# EAGLE schematic OmniRotor-v1 (EAGLE 5.10)
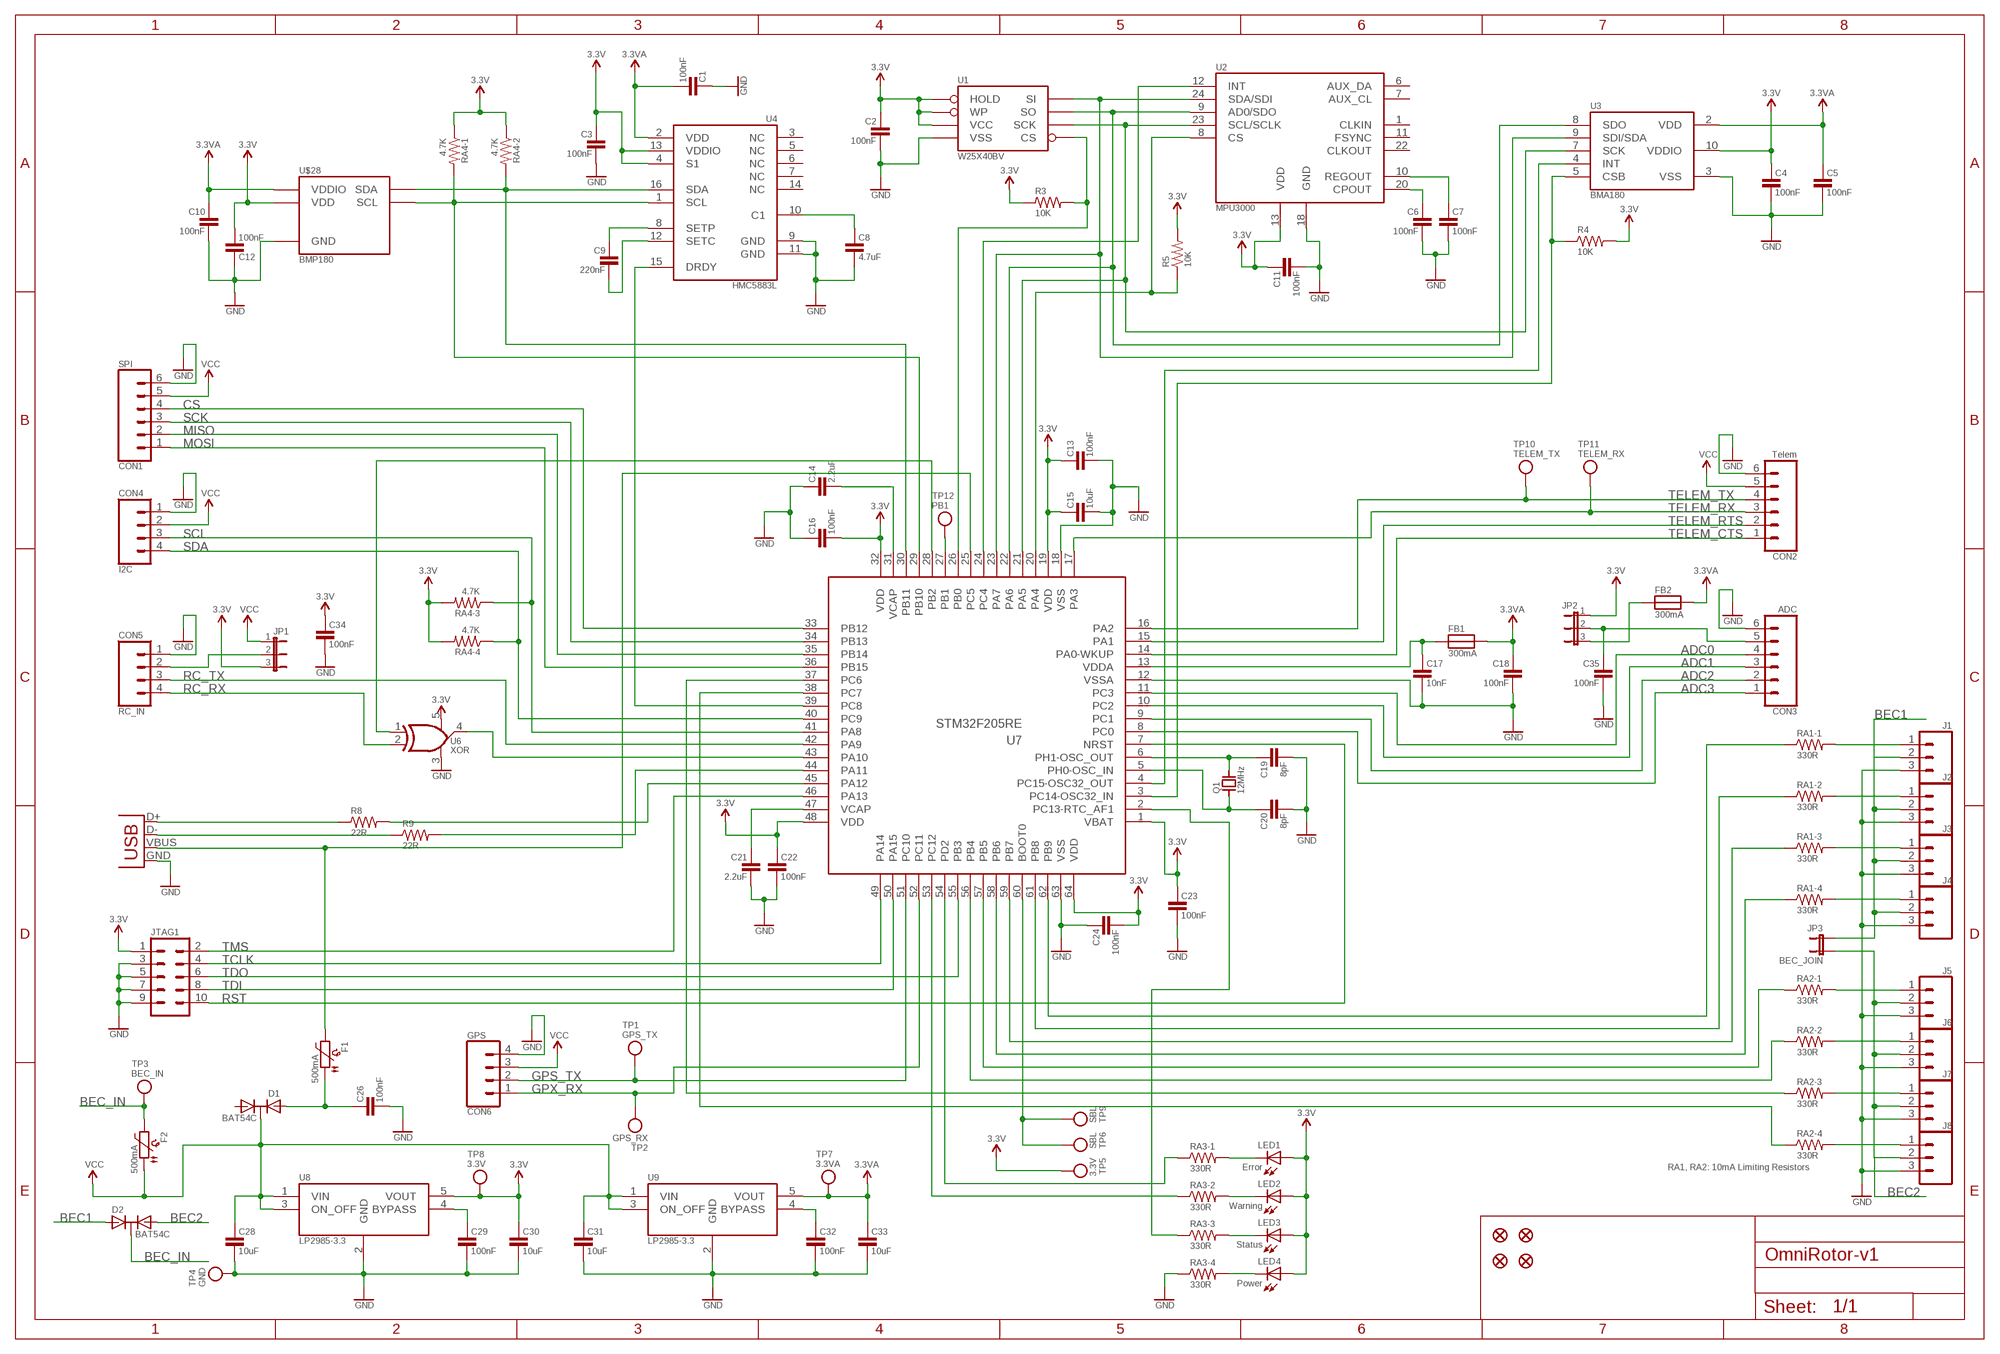
[diagram p0: schematic, sheet 1]

## Parts
C1  100nF  CAPACITOR0402  [0402-CAP]
C2  100nF  CAPACITOR0402  [0402-CAP]
C3  100nF  CAPACITOR0402  [0402-CAP]
C4  100nF  CAPACITOR0402  [0402-CAP]
C5  100nF  CAPACITOR0402  [0402-CAP]
C6  100nF  CAPACITOR0402  [0402-CAP]
C7  100nF  CAPACITOR0402  [0402-CAP]
C8  4.7uF  CAPACITOR0603  [0603]
C9  220nF  CAPACITOR0402  [0402-CAP]
C10  100nF  CAPACITOR0402  [0402-CAP]
C11  100nF  CAPACITOR0402  [0402-CAP]
C12  100nF  CAPACITOR0402  [0402-CAP]
C13  100nF  CAPACITOR0402  [0402-CAP]
C14  2.2uF  CAPACITOR0603  [0603]
C15  10uF  CAPACITOR-CERAMIC0805  [0805]
C16  100nF  CAPACITOR0402  [0402-CAP]
C17  10nF  CAPACITOR0402  [0402-CAP]
C18  100nF  CAPACITOR0402  [0402-CAP]
C19  8pF  CAPACITOR0402  [0402-CAP]
C20  8pF  CAPACITOR0402  [0402-CAP]
C21  2.2uF  CAPACITOR0603  [0603]
C22  100nF  CAPACITOR0402  [0402-CAP]
C23  100nF  CAPACITOR0402  [0402-CAP]
C24  100nF  CAPACITOR0402  [0402-CAP]
C26  100nF  CAPACITOR0402  [0402-CAP]
C28  10uF  CAPACITOR-CERAMIC0805  [0805]
C29  100nF  CAPACITOR0402  [0402-CAP]
C30  10uF  CAPACITOR-CERAMIC0805  [0805]
C31  10uF  CAPACITOR-CERAMIC0805  [0805]
C32  100nF  CAPACITOR0402  [0402-CAP]
C33  10uF  CAPACITOR-CERAMIC0805  [0805]
C34  100nF  CAPACITOR0402  [0402-CAP]
C35  100nF  CAPACITOR0402  [0402-CAP]
CON1  SPI  M06JST-SH-SIDE  [SM06B-SRSS-TB]
CON2  Telem  M06JST-SH-SIDE  [SM06B-SRSS-TB]
CON3  ADC  M06JST-SH-SIDE  [SM06B-SRSS-TB]
CON4  I2C  M04JST-SH-SIDE  [SM04B-SRSS-TB]
CON5  RC_IN  M04JST-SH-SIDE  [SM04B-SRSS-TB]
CON6  GPS  M04JST-SH-SIDE  [SM04B-SRSS-TB]
D1  BAT54C  [SOT23]
D2  BAT54C  [SOT23]
F1  500mA  PTC1812  [1812]
F2  500mA  PTC1812  [1812]
FB1  300mA  FERRITE0603  [0603]
FB2  300mA  FERRITE0603  [0603]
FID1  FIDUCIAL1X2.5  [FIDUCIAL-1X2.5]
FID2  FIDUCIAL1X2.5  [FIDUCIAL-1X2.5]
FID3  FIDUCIAL1X2.5  [FIDUCIAL-1X2.5]
FID4  FIDUCIAL1X2.5  [FIDUCIAL-1X2.5]
J1  M03PTH  [1X03]
J2  M03PTH  [1X03]
J3  M03PTH  [1X03]
J4  M03PTH  [1X03]
J5  M03PTH  [1X03]
J6  M03PTH  [1X03]
J7  M03PTH  [1X03]
J8  M03PTH  [1X03]
JP1  JUMPER-32-3  [SJ_3_PASTE2&3]
JP2  JUMPER-31-2  [SJ_3_PASTE1&2]
JP3  BEC_JOIN  JUMPER-2NO  [SJ_2_NO]
JTAG1  JTAGSWD  [2X05-0.05IN]
LED1  Error  LED0603-LP  [0603_LED_VLPXXX_LIGHTPIPES]
LED2  Warning  LED0603-LP  [0603_LED_VLPXXX_LIGHTPIPES]
LED3  Status  LED0603-LP  [0603_LED_VLPXXX_LIGHTPIPES]
LED4  Power  LED0603-LP  [0603_LED_VLPXXX_LIGHTPIPES]
Q1  12MHz  CRYSTAL5X3-2  [CRYSTAL-5X3-2]
R3  10K  RESISTOR0402  [0402-RES]
R4  10K  RESISTOR0402  [0402-RES]
R5  10K  RESISTOR0402  [0402-RES]
R8  22R  RESISTOR0402  [0402-RES]
R9  22R  RESISTOR0402  [0402-RES]
RA1  330R  RESISTOR-ARRAY-1206  [1206-ARRAY]
RA2  330R  RESISTOR-ARRAY-1206  [1206-ARRAY]
RA3  330R  RESISTOR-ARRAY-1206  [1206-ARRAY]
RA4  4.7K  RESISTOR-ARRAY-1206  [1206-ARRAY]
TP1  GPS_TX  TESTPOINTROUND1MM  [TESTPOINT_ROUND_1MM]
TP2  GPS_RX  TESTPOINTROUND1MM  [TESTPOINT_ROUND_1MM]
TP3  BEC_IN  TESTPOINTROUND1.5MM  [TESTPOINT_ROUND_1.5MM]
TP4  GND  TESTPOINTROUND1.5MM  [TESTPOINT_ROUND_1.5MM]
TP5  3.3V  TESTPOINTROUND1.5MM  [TESTPOINT_ROUND_1.5MM]
TP6  SBL  TESTPOINTROUND1.5MM  [TESTPOINT_ROUND_1.5MM]
TP7  3.3VA  TESTPOINTROUND1MM  [TESTPOINT_ROUND_1MM]
TP8  3.3V  TESTPOINTROUND1MM  [TESTPOINT_ROUND_1MM]
TP9  SBL  TESTPOINTROUND1MM  [TESTPOINT_ROUND_1MM]
TP10  TELEM_TX  TESTPOINTROUND1MM  [TESTPOINT_ROUND_1MM]
TP11  TELEM_RX  TESTPOINTROUND1MM  [TESTPOINT_ROUND_1MM]
TP12  PB1  TESTPOINTROUND1MM  [TESTPOINT_ROUND_1MM]
U1  W25X40BV  W25X40BVSOIC  [SOIC8]
U2  MPU3000  [QFN-24]
U3  BMA180  [LGA12]
U4  HMC5883L  [16LPCC]
U6  XOR  74LVC1G86SC70  [SC-70-5]
U7  STM32F205RE  [LQFP64]
U8  LP2985-3.3  LP2985  [SOT-23-5]
U9  LP2985-3.3  LP2985  [SOT-23-5]
U$28  BMP180  [BMP180]
USB1  USB-MICRO-B  USBMICRO-B  [USB-MICRO-B]

## Nets
3.3V: C2.1 C3.1 C4.1 C11.1 C12.2 C13.1 C15.1 C16.2 C22.1 C23.1 C24.2 C30.1 C34.1 JP1.3 JP2.1 JTAG1.1 LED1.1(A) LED2.1(A) LED3.1(A) LED4.1(A) R3.1 R4.2 R5.2 RA4.A1 RA4.B1 RA4.C2 RA4.D2 TP5.1 TP8.1 U1.3(WP) U1.7(HOLD) U1.8(VCC) U2.13(VDD) U3.10(VDDIO) U4.4(S1) U4.13(VDDIO) U6.5(VCC) U7.1(VBAT) U7.19(VDD) U7.32(VDD) U7.48(VDD) U7.64(VDD) U8.5(VOUT)
3.3VA: C1.2 C5.1 C10.1 C18.1 C33.1 FB1.2 FB2.2 TP7.1 U3.2(VDD) U4.2(VDD) U9.5(VOUT) U$28.3(VDDIO)
ADC0: CON3.4 U7.11(PC3)
ADC1: CON3.3 U7.10(PC2)
ADC2: CON3.2 U7.9(PC1)
ADC3: CON3.1 U7.8(PC0)
BEC1: D2.1 J1.2 J2.2 J3.2 J4.2 JP3.1
BEC2: D2.2 J5.2 J6.2 J7.2 J8.2 JP3.2
BEC_IN: D2.3 F2.1 TP3.1
CS: CON1.4 U7.33(PB12)
GND: C1.1 C2.2 C3.2 C4.2 C5.2 C6.2 C7.2 C8.2 C10.2 C11.2 C12.1 C13.2 C14.1 C15.2 C16.1 C17.2 C18.2 C19.2 C20.2 C21.2 C22.2 C23.2 C24.1 C26.2 C28.2 C29.2 C30.2 C31.2 C32.2 C33.2 C34.2 C35.2 CON1.6 CON2.6 CON3.6 CON4.1 CON5.1 CON6.4 J1.3 J2.3 J3.3 J4.3 J5.3 J6.3 J7.3 J8.3 JTAG1.3 JTAG1.5 JTAG1.7 JTAG1.9 RA3.D1 TP4.1 U1.4(VSS) U2.18(GND) U3.3(VSS) U4.9(GND) U4.11(GND) U6.3(GND) U7.12(VSSA) U7.18(VSS) U7.63(VSS) U8.2(GND) U9.2(GND) U$28.7(GND) USB1.GND
GPS_TX: CON6.2 TP1.1 U7.51(PC10)
GPX_RX: CON6.1 TP2.1 U7.52(PC11)
MISO: CON1.2 U7.35(PB14)
MOSI: CON1.1 U7.36(PB15)
N$1: C17.1 FB1.1 U7.13(VDDA)
N$2: C19.1 Q1.2 U7.6(PH1-OSC_OUT)
N$3: C20.1 Q1.1 U7.5(PH0-OSC_IN)
N$4: C26.1 D1.1 F1.2
N$5: C29.1 U8.4(BYPASS)
N$6: CON5.2 JP1.2
N$7: C32.1 U9.4(BYPASS)
N$8: R8.1 USB1.D+
N$9: R9.1 USB1.D-
N$10: R9.2 U7.44(PA11)
N$11: R8.2 U7.45(PA12)
N$13: U6.4(O) U7.43(PA10)
N$14: U6.1(I0) U7.28(PB2)
N$15: C9.1 U4.8(SETP)
N$16: C9.2 U4.12(SETC)
N$17: R5.1 U2.8(CS) U7.20(PA4)
N$18: U4.15(DRDY) U7.39(PC8)
N$19: TP12.1 U7.27(PB1)
N$20: C8.1 U4.10(C1)
N$21: C35.1 CON3.5 JP2.2
N$22: U1.5(SI) U2.24(SDA/SDI) U3.9(SDI/SDA) U7.23(PA7)
N$23: RA4.A2 U4.1(SCL) U7.29(PB10) U$28.5(SCL)
N$24: RA4.B2 U4.16(SDA) U7.30(PB11) U$28.6(SDA)
N$25: U1.2(SO) U2.9(AD0/SDO) U3.8(SDO) U7.22(PA6)
N$26: R3.2 U1.1(CS) U7.26(PB0)
N$27: U1.6(SCK) U2.23(SCL/SCLK) U3.7(SCK) U7.21(PA5)
N$28: U2.12(INT) U7.24(PC4)
N$29: FB2.1 JP2.3
N$30: U3.4(INT) U7.4(PC15-OSC32_OUT)
N$31: C6.1 U2.20(CPOUT)
N$32: C7.1 U2.10(REGOUT)
N$33: R4.1 U3.5(CSB) U7.3(PC14-OSC32_IN)
N$34: J2.1 RA1.B2
N$35: J3.1 RA1.C2
N$36: J4.1 RA1.D2
N$37: J1.1 RA1.A2
N$38: J6.1 RA2.B2
N$39: J7.1 RA2.C2
N$40: J8.1 RA2.D2
N$41: J5.1 RA2.A2
N$42: RA1.D1 U7.58(PB6)
N$43: RA1.C1 U7.59(PB7)
N$44: RA1.B1 U7.61(PB8)
N$45: RA1.A1 U7.62(PB9)
N$46: TP6.1 TP9.1 U7.60(BOOT0)
N$47: RA2.A1 U7.57(PB5)
N$48: RA2.B1 U7.56(PB4)
N$49: RA2.C1 U7.37(PC6)
N$50: RA2.D1 U7.38(PC7)
N$51: LED1.2(C) RA3.A2
N$52: LED2.2(C) RA3.B2
N$53: LED3.2(C) RA3.C2
N$54: LED4.2(C) RA3.D2
N$55: RA3.B1 U7.53(PC12)
N$56: RA3.A1 U7.54(PD2)
N$57: RA3.C1 U7.2(PC13-RTC_AF1)
RC_RX: CON5.4 U6.2(I1)
RC_TX: CON5.3 U7.42(PA9)
RST: JTAG1.10 U7.7(NRST)
SCK: CON1.3 U7.34(PB13)
SCL: CON4.3 RA4.C1 U7.41(PA8)
SDA: CON4.4 RA4.D1 U7.40(PC9)
TCLK: JTAG1.4 U7.49(PA14)
TDI: JTAG1.8 U7.50(PA15)
TDO: JTAG1.6 U7.55(PB3)
TELEM_CTS: CON2.1 U7.14(PA0-WKUP)
TELEM_RTS: CON2.2 U7.15(PA1)
TELEM_RX: CON2.3 TP11.1 U7.17(PA3)
TELEM_TX: CON2.4 TP10.1 U7.16(PA2)
TMS: JTAG1.2 U7.46(PA13)
VCAP: C21.1 U7.47(VCAP)
VCAP2: C14.2 U7.31(VCAP)
VCC: C28.1 C31.1 CON1.5 CON2.5 CON4.2 CON6.3 D1.3 F2.2 JP1.1 U8.1(VIN) U8.3(ON_OFF) U9.1(VIN) U9.3(ON_OFF)
VUSB: F1.1 U7.25(PC5) USB1.VBUS
Unconnected: D1.2 U2.1(CLKIN) U2.6(AUX_DA) U2.7(AUX_CL) U2.11(FSYNC) U2.22(CLKOUT) U4.3(NC) U4.5(NC) U4.6(NC) U4.7(NC) U4.14(NC)

## Notes on the sheet
- RA1, RA2: 10mA Limiting Resistors

## Power pins joined to a net without a drawn wire
VDD: U$28.2(VDD)

## Library data of the parts
C1-C14 C16-C24 C26 C29 C32 C34 C35 = OmniLoco:CAPACITOR: Capacitor Standard SMD ceramic capacitors.
C15 C28 C30 C31 C33 = OmniLoco:CAPACITOR-CERAMIC: Ceramic Capacitors 0402 - 0402 Surface Mount Capacitors 18pF 50V 5% [Digikey: 587-1950-1-ND] 10nF 6.3V 10% [Digikey: 311-1349-1-ND] 0.1uF 10V 10% [Digikey: 587-1227-1-ND] 0.1uF 16V 10% [Digikey: 587-1451-1-ND] 0.22uF 6.3V 10% [Digikey: 587-1229-1-ND] 0603 - 0603 Surface Mount Capacitors 2.2uF 6.3V 10% [Digikey: 587-1254-1-ND] 2.2uF 10V 10% [Digikey: 587-1253-1-ND] 4.7uF 6.3V 10% [Digikey: 587-1785-1-ND] 0805 - 0805 Surface Mount Capacitors 10uF 16V 10% [Digikey: 587-1295-1-ND]
CON1-CON3 = OmniLoco:M06: Six Way Connector JST SH/SR Vertical Connector - BM06B-SRSS-TB(LF)(SN) [Digikey: 455-1792-1-ND] JST SH/SR Right-Angle Connector - SM06B-SRSS-TB(LF)(SN) [Digikey: 455-1806-1-ND] JST-SH-TOP - Vertical JST-SH footprint. JST-SH-SIDE - Right-angle JST-SH footprint.
CON4-CON6 = OmniLoco:M04: Four Way Connector JST SH/SR Vertical Connector - BM04B-SRSS-TB(LF)(SN)(P) [Digikey: 455-1790-1-ND] JST SH/SR Right-Angle Connector - SM04B-SRSS-TB(LF)(SN)(P) [Digikey: 455-1804-1-ND] JST-SH-TOP - Vertical JST-SH footprint. JST-SH-SIDE - Right-angle JST-SH footprint.
D1 D2 = OmniLoco:BAT54C: BAT54C Schottky Diodes (Common Cathode) Vf: 800mV, 30V 200mA - BAT543C [Digikey: BAT54CFSCT-ND] Vf: 900mV, 40V 300mA - BAT54CFILM [Digikey: 497-3786-2-ND]
F1 F2 = OmniLoco:PTC: PTC (Resettable Fuse) 1812 Package 200mA PTC (30V Max, Time-to-Trip: 0.02s) - Digikey: 507-1496-1-ND 750mA PTC (24V Max, Time-to-Trip: 0.2s) - Digikey: MF-MSMF075/24-2CT-ND
FB1 FB2 = OmniLoco:FERRITE: Ferrite Bead 0603 HZ0603B102R-10 - 1K Ohm, 200mA [Digikey: 240-2378-1-ND] 742792664 - 1K Ohm, 300mA [Digikey: 732-1586-1-ND]
FID1-FID4 = OmniLoco:FIDUCIAL: Fiducial Alignment Points Various fiducial points for machine vision alignment.
J1-J8 = OmniLoco:M03: Three Way Connector PTH - Standard 0.1" through-hole footprint.
JP1 JP2 = OmniLoco:JUMPER-3: Three Way Jumpers
JP3 = OmniLoco:JUMPER-2: Two Way Jumpers
JTAG1 = OmniLoco:JTAG: JTAG Connector 0.05" SWD Vertical - GRPB052VWQS-RC - [Digikey: S9012E-05-ND]
LED1-LED4 = OmniLoco:LED: LED - Light Emmiting Diodes LED 0603 (20mA 220mCd Vf1.95) Red - APT1608SURCK [Digikey: 754-1123-1-ND] LED 0603 (20mA 240mCd Vf=2.1) Orange - APT1608SECK [Digikey: 754-1120-1-ND] LED 0603 (20mA 100mCd Vf=3.3) Blue - APT1608QBC/D [Digikey: 754-1434-1-ND] LED 0603 (20mA 50mCd Vf=2.1) Green - APT1608CGCK [Digikey: 754-1116-1-ND] Light Pipes 0.400" (10.16mm) High Round Lightpipe - VLP-400-R [Digikey: VLP-400-R-ND] 0.350" (8.89mm) High Round Lightpipe - VLP-350-F [Digikey: 492-1309-ND] 0603 - Standard 0603 footprint with LED silkscreen markings. 0603-LP - Standard 0603 footprint with mounting holes and clearances for VLP-XXX series lightpipes. 1206 - Standard 1206 footprint.
Q1 = OmniLoco:CRYSTAL: Crystals 5x3.2MM 2SMD - Surface Mount Crystal 12.0MHz 8pF +/-30ppm [Digikey: 644-1034-1-ND] 5x3.2MM 4SMD - Surface Mount Crystal 8.0MHz 18pF +/-50ppm [Digikey: 535-9720-1-ND]
R3-R5 R8 R9 = OmniLoco:RESISTOR: Resistors 0402 - 0402 Surface Mount Resistors 22 Ohm 1/16W 5% [Digikey: 311-22JRCT-ND] 4.7K Ohm 1/16W 5% [Digikey: 311-4.7KJRCT-ND] 10K Ohm 1/16W 5% [Digikey: 311-10KJRCT-ND]
RA1-RA4 = OmniLoco:RESISTOR-ARRAY: Resistor Arrays 1206 (Concave) - 1206 (Concave) Surface Mount Resistor Arrays 330 Ohm 1/16W 5% [Digikey: TC164J-330CT-ND]
TP1-TP12 = OmniLoco:TESTPOINT: Testpoint Footprints for testpoints, commonly used for debugging or connection points for pogopins. POGOPIN1MM - Throughhole footprint for 1mm pogopins. ROUND1MM - Smallest testpoint, for use with pogopins. ROUND1.5MM - Larger testpoint, more suited to handheld probing.
U1 = OmniLoco:W25X40BV: W25Xx0BV - SPI Flash 4Mbit SPI Flash - W25X40BVSNIG [Digikey: W25X40BVSNIG-ND]
U2 = OmniLoco:MPU3000: MPU3000 - Invensense Digital Gyroscope 3 Axis Digital Gyroscope - MPU3000 [Invensense: MPU-3000]
U3 = OmniLoco:BMA180: BMA180 - Bosch Sensortec Accelerometer 3-Axis Accelerometer - BMA180 [Digikey: 828-1019-1-ND]
U4 = OmniLoco:HMC5883L: HMC5883L - Honeywell Magnetic Sensor 3 Axis Digital Compass IC - HMC5883L [Digikey: 342-1082-1-ND]
U6 = OmniLoco:74LVC1G86: XOR Logic Gate - 7400 Series Logic Exclusive OR Gate (Inverter) SC-70-5 - SN74LVC1G86DCKR [Digikey: 296-9854-1-ND] Exclusive OR Gate (Inverter) SOT353 - 74LVC1G86SE-7 [Digikey: 74LVC1G86SE-7DICT-ND] SOT353 - Standard SOT353 package. SC70 - Smaller SC-70-5 package for high density designs.
U7 = OmniLoco:STM32F205
U8 U9 = OmniLoco:LP2985: LP2985 - Low Dropout Linear Regulator 3.3V 150mA - LP2985-33DBVR [Digikey: 296-18476-1-ND]
U$28 = OmniLoco:BMP180: BMP180 - Bosch Sensortec Pressure Sensor Barometric Pressure Sensor - BMP180 [Digikey: 828-1027-1-ND]
USB1 = OmniLoco:USB: USB Connectors Micro USB - ZX62-B-5PA(11) [Digikey: H11634CT-ND]